# Altium schematic sheet FMC_HPC2.SchDoc: AMC FMC Carrier v4
size A2; CompanyName: WUT; Organization: WUT ISE; Address1: Warsaw Univeristy of Technology; Address2: Nowowiejska 15/19 00-665 Warsaw; Address3: t.przywozki@gmail.com; Revision: 1; SheetNumber: 8; SheetTotal: 29; Project: AMC FMC Carrier v4; ModifiedBy: -; CheckedDate: -; Title2: FPGA banks HPC2 / RTM; DivGrp: ISE; Designer: T. Przywozki; ModifiedDate: -; ProjectName: ADC/DAC MEZZANINE
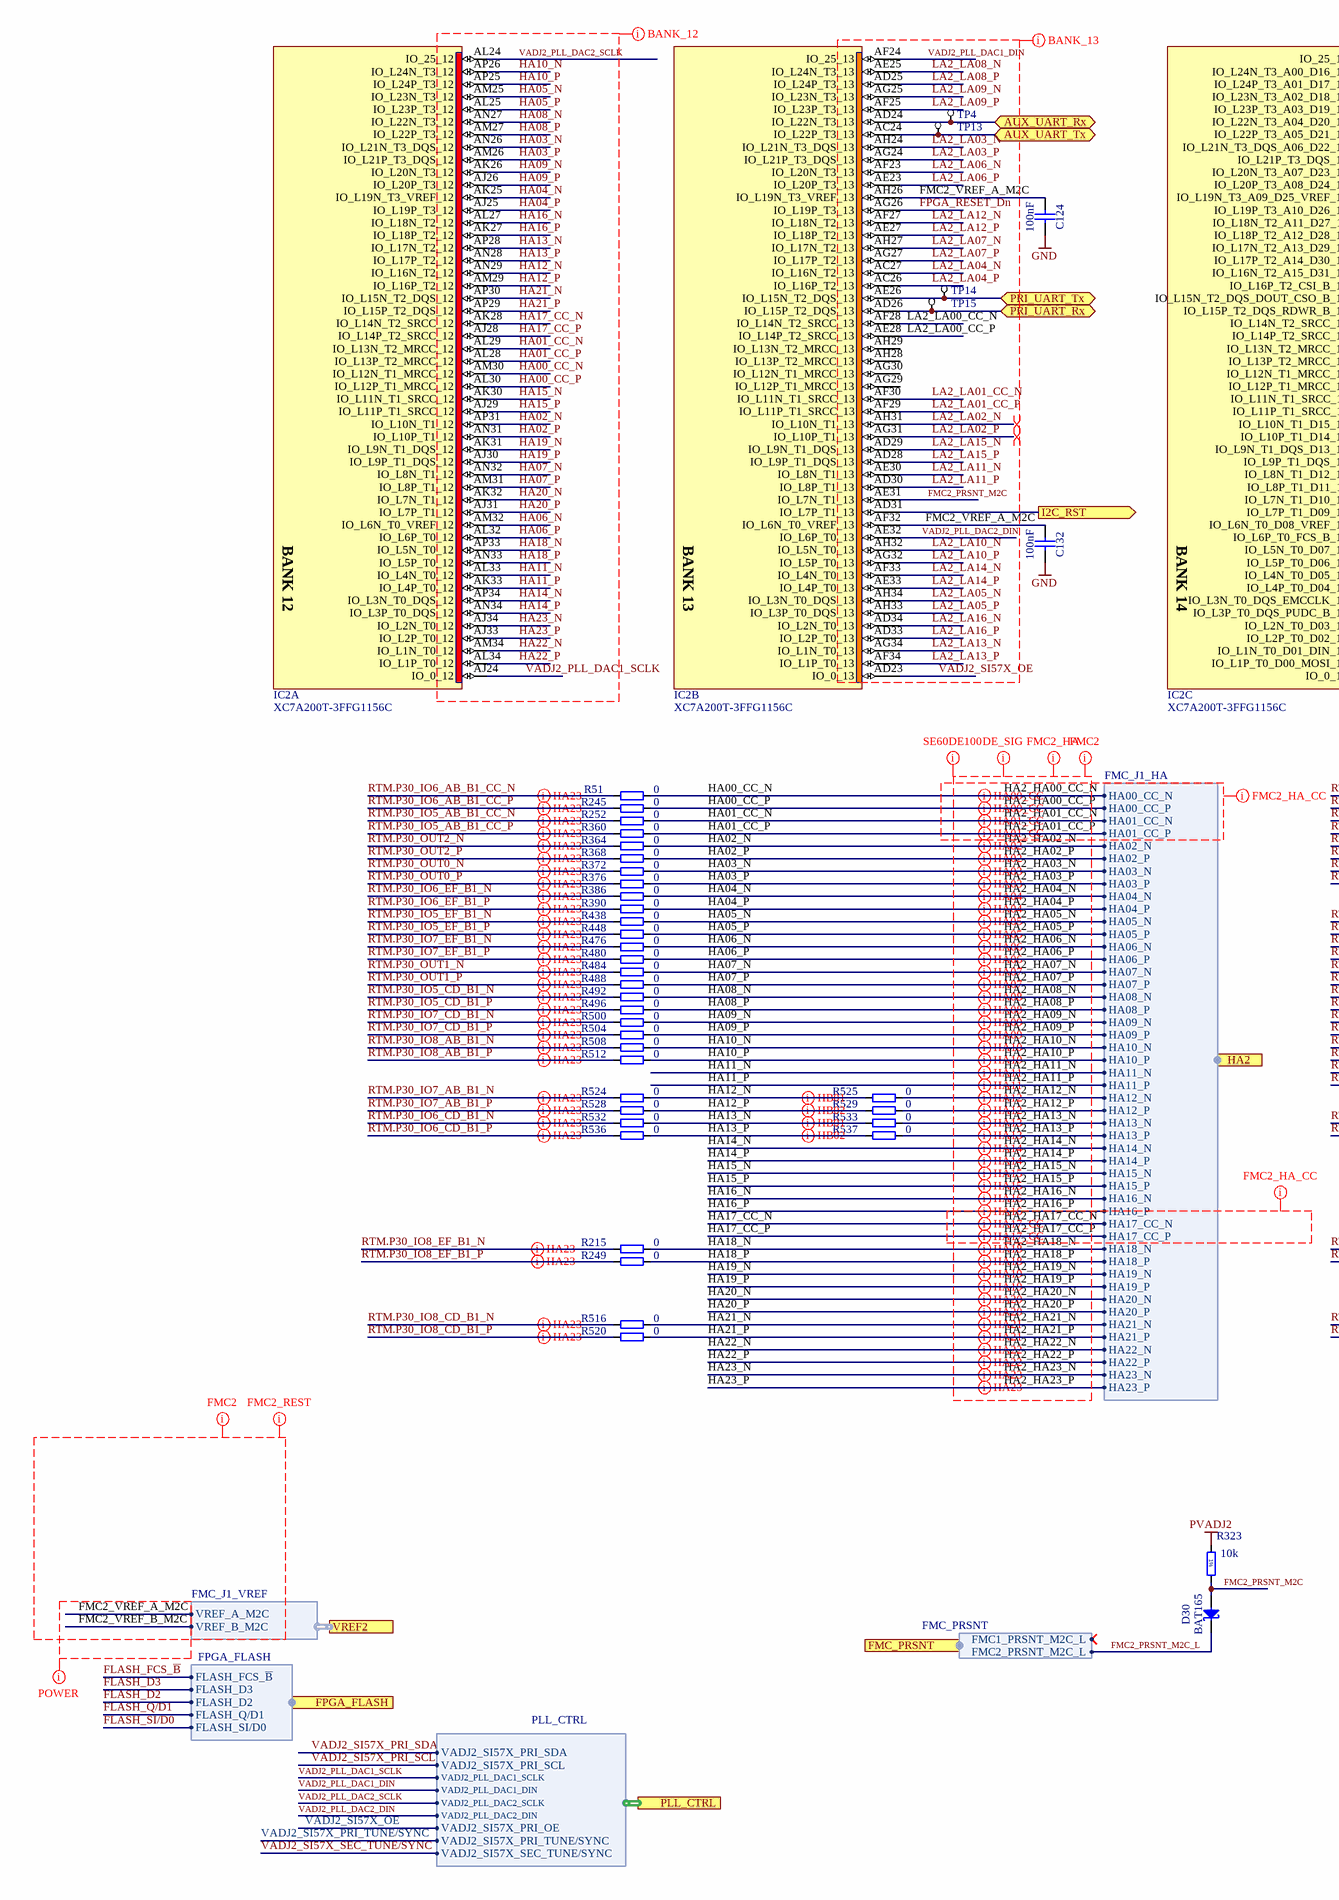
[diagram p0: FMC_HPC2.SchDoc, left]
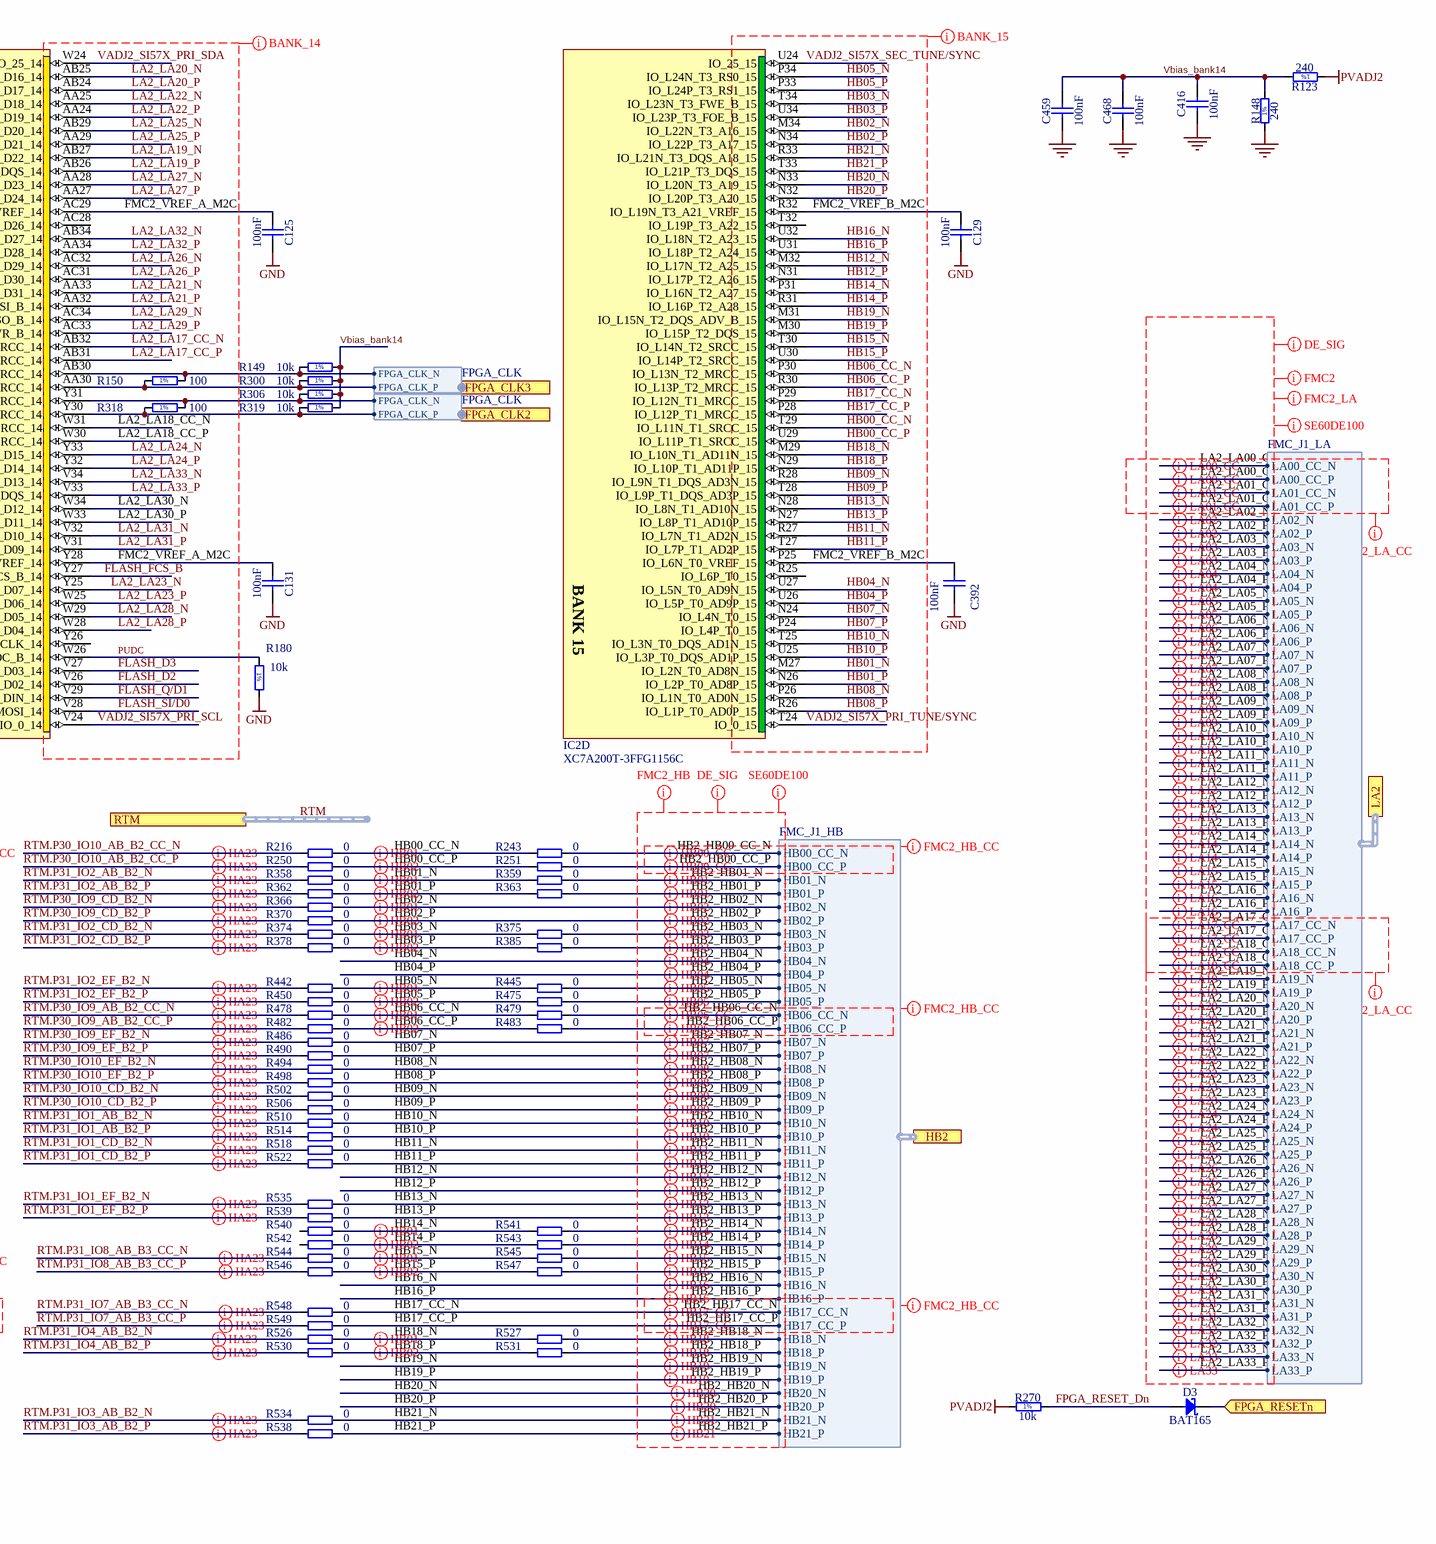
[diagram p1: FMC_HPC2.SchDoc, right]

## Parts
C124  100nF  [CAPC0603X33N]
C125  100nF  [CAPC0603X33N]
C129  100nF  [CAPC0603X33N]
C131  100nF  [CAPC0603X33N]
C132  100nF  [CAPC0603X33N]
C392  100nF  [CAPC0603X33N]
C416  100nF  [CAPC0603X33N]
C459  100nF  [CAPC0603X33N]
C468  100nF  [CAPC0603X33N]
D3  BAT165  [SOD2512X110N]
D30  BAT165  [SOD2512X110N]
IC2  XC7A200T-3FFG1156C  [BGA1156C100P34X34_3500X3500X335]  (parts A,B,C,D of 23)
R51  0  [RESC0603X28N]
R123  240  [RESC1005X40N]
R148  240  [RESC1005X40N]
R149  10k  [RESC1005X40N]
R150  100  [RESC0603X28N]
R180  10k  [RESC1005X40N]
R215  0  [RESC0603X28N]
R216  0  [RESC0603X28N]
R243  0  [RESC0603X28N]
R245  0  [RESC0603X28N]
R249  0  [RESC0603X28N]
R250  0  [RESC0603X28N]
R251  0  [RESC0603X28N]
R252  0  [RESC0603X28N]
R270  10k  [RESC1005X40N]
R300  10k  [RESC1005X40N]
R306  10k  [RESC1005X40N]
R318  100  [RESC0603X28N]
R319  10k  [RESC1005X40N]
R323  10k  [RESC1005X40N]
R358  0  [RESC0603X28N]
R359  0  [RESC0603X28N]
R360  0  [RESC0603X28N]
R362  0  [RESC0603X28N]
R363  0  [RESC0603X28N]
R364  0  [RESC0603X28N]
R366  0  [RESC0603X28N]
R368  0  [RESC0603X28N]
R370  0  [RESC0603X28N]
R372  0  [RESC0603X28N]
R374  0  [RESC0603X28N]
R375  0  [RESC0603X28N]
R376  0  [RESC0603X28N]
R378  0  [RESC0603X28N]
R385  0  [RESC0603X28N]
R386  0  [RESC0603X28N]
R390  0  [RESC0603X28N]
R438  0  [RESC0603X28N]
R442  0  [RESC0603X28N]
R445  0  [RESC0603X28N]
R448  0  [RESC0603X28N]
R450  0  [RESC0603X28N]
R475  0  [RESC0603X28N]
R476  0  [RESC0603X28N]
R478  0  [RESC0603X28N]
R479  0  [RESC0603X28N]
R480  0  [RESC0603X28N]
R482  0  [RESC0603X28N]
R483  0  [RESC0603X28N]
R484  0  [RESC0603X28N]
R486  0  [RESC0603X28N]
R488  0  [RESC0603X28N]
R490  0  [RESC0603X28N]
R492  0  [RESC0603X28N]
R494  0  [RESC0603X28N]
R496  0  [RESC0603X28N]
R498  0  [RESC0603X28N]
R500  0  [RESC0603X28N]
R502  0  [RESC0603X28N]
R504  0  [RESC0603X28N]
R506  0  [RESC0603X28N]
R508  0  [RESC0603X28N]
R510  0  [RESC0603X28N]
R512  0  [RESC0603X28N]
R514  0  [RESC0603X28N]
R516  0  [RESC0603X28N]
R518  0  [RESC0603X28N]
R520  0  [RESC0603X28N]
R522  0  [RESC0603X28N]
R524  0  [RESC0603X28N]
R525  0  [RESC0603X28N]
R526  0  [RESC0603X28N]
R527  0  [RESC0603X28N]
R528  0  [RESC0603X28N]
R529  0  [RESC0603X28N]
R530  0  [RESC0603X28N]
R531  0  [RESC0603X28N]
R532  0  [RESC0603X28N]
R533  0  [RESC0603X28N]
R534  0  [RESC0603X28N]
R535  0  [RESC0603X28N]
R536  0  [RESC0603X28N]
R537  0  [RESC0603X28N]
R538  0  [RESC0603X28N]
R539  0  [RESC0603X28N]
R540  0  [RESC0603X28N]
R541  0  [RESC0603X28N]
R542  0  [RESC0603X28N]
R543  0  [RESC0603X28N]
R544  0  [RESC0603X28N]
R545  0  [RESC0603X28N]
R546  0  [RESC0603X28N]
R547  0  [RESC0603X28N]
R548  0  [RESC0603X28N]
R549  0  [RESC0603X28N]
TP4  TP  [TP_large]  (value not drawn)
TP13  TP  [TP_large]  (value not drawn)
TP14  TP  [TP_large]  (value not drawn)
TP15  TP  [TP_large]  (value not drawn)

## Ports
AUX_UART_Rx (bidir), AUX_UART_Tx (bidir), FMC_PRSNT (harness FMC_PRSNT), FPGA_CLK2 (harness FPGA_CLK), FPGA_CLK3 (harness FPGA_CLK), FPGA_FLASH (harness FPGA_FLASH), FPGA_RESETn (in), HA2 (harness FMC_J1_HA), HB2 (harness FMC_J1_HB), I2C_RST (out), LA2 (harness FMC_J1_LA), PLL_CTRL (harness PLL_CTRL), PRI_UART_Rx (bidir), PRI_UART_Tx (bidir), RTM (harness RTM), VREF2 (harness FMC_J1_VREF)

## Harnesses
FMC_J1_LA: LA05_N, LA05_P, LA06_N, LA06_P, LA09_N, LA09_P, LA10_N, LA10_P, LA13_N, LA13_P, LA14_N, LA14_P, LA23_N, LA23_P, LA26_N, LA26_P, LA27_N, LA27_P, LA02_N, LA02_P, LA03_N, LA03_P, LA04_N, LA04_P, LA07_N, LA07_P, LA08_N, LA08_P, LA11_N, LA11_P, LA12_N, LA12_P, LA15_N, LA15_P, LA16_N, LA16_P, LA19_N, LA19_P, LA20_N, LA20_P, LA21_N, LA21_P, LA22_N, LA22_P, LA24_N, LA24_P, LA25_N, LA25_P, LA28_N, LA28_P, LA29_N, LA29_P, LA30_N, LA30_P, LA31_N, LA31_P, LA32_N, LA32_P, LA33_N, LA33_P, LA00_CC_N, LA00_CC_P, LA01_CC_N, LA01_CC_P, LA17_CC_N, LA17_CC_P, LA18_CC_N, LA18_CC_P
FMC_J1_HA: HA04_N, HA04_P, HA05_N, HA05_P, HA08_N, HA08_P, HA09_N, HA09_P, HA12_N, HA12_P, HA13_N, HA13_P, HA15_N, HA15_P, HA16_N, HA16_P, HA19_N, HA19_P, HA20_N, HA20_P, HA02_N, HA02_P, HA03_N, HA03_P, HA06_N, HA06_P, HA07_N, HA07_P, HA10_N, HA10_P, HA11_N, HA11_P, HA14_N, HA14_P, HA18_N, HA18_P, HA21_N, HA21_P, HA22_N, HA22_P, HA23_N, HA23_P, HA17_CC_N, HA17_CC_P, HA00_CC_N, HA00_CC_P, HA01_CC_N, HA01_CC_P
FMC_J1_HB: HB02_N, HB02_P, HB03_N, HB03_P, HB04_N, HB04_P, HB05_N, HB05_P, HB08_N, HB08_P, HB09_N, HB09_P, HB12_N, HB12_P, HB13_N, HB13_P, HB16_N, HB16_P, HB19_N, HB19_P, HB20_N, HB20_P, HB21_N, HB21_P, HB01_N, HB01_P, HB07_N, HB07_P, HB10_N, HB10_P, HB11_N, HB11_P, HB14_N, HB14_P, HB15_N, HB15_P, HB18_N, HB18_P, HB17_CC_N, HB17_CC_P, HB06_CC_N, HB06_CC_P, HB00_CC_N, HB00_CC_P
FPGA_FLASH: FLASH_FCS_~{B}, FLASH_D3, FLASH_D2, FLASH_Q/D1, FLASH_SI/D0
FMC_J1_VREF: VREF_A_M2C, VREF_B_M2C
FPGA_CLK: FPGA_CLK_N, FPGA_CLK_P
FMC_PRSNT: FMC1_PRSNT_M2C_L, FMC2_PRSNT_M2C_L
PLL_CTRL: VADJ2_PLL_DAC1_SCLK, VADJ2_PLL_DAC1_DIN, VADJ2_SI57X_PRI_OE, VADJ2_SI57X_PRI_TUNE/SYNC, VADJ2_SI57X_PRI_SDA, VADJ2_SI57X_PRI_SCL, VADJ2_SI57X_SEC_TUNE/SYNC, VADJ2_PLL_DAC2_SCLK, VADJ2_PLL_DAC2_DIN

## Nets
GND: C124.2 C125.2 C129.2 C131.2 C132.2 C392.2 C416.2 C459.2 C468.2 R148.1 R180.2
PVADJ2: R123.1 R270.1 R323.1
AUX_UART_Rx: IC2.AD24(IO_L22N_T3_13) TP4.1 ; port AUX_UART_Rx
AUX_UART_Tx: IC2.AC24(IO_L22P_T3_13) TP13.1 ; port AUX_UART_Tx
FLASH_D2: IC2.V26(IO_L2P_T0_D02_14) ; port FPGA_FLASH.FLASH_D2
FLASH_D3: IC2.V27(IO_L2N_T0_D03_14) ; port FPGA_FLASH.FLASH_D3
FLASH_FCS_~{B}: IC2.Y27(IO_L6P_T0_FCS_B_14) ; port FPGA_FLASH.FLASH_FCS_~{B}
FLASH_Q/D1: IC2.V29(IO_L1N_T0_D01_DIN_14) ; port FPGA_FLASH.FLASH_Q/D1
FLASH_SI/D0: IC2.V28(IO_L1P_T0_D00_MOSI_14) ; port FPGA_FLASH.FLASH_SI/D0
FMC2_PRSNT_M2C: D30.2(A) IC2.AE31(IO_L7N_T1_13) R323.2
FMC2_PRSNT_M2C_L: D30.1(C) ; port FMC_PRSNT.FMC2_PRSNT_M2C_L
FMC2_VREF_A_M2C: C124.1 C125.1 C131.1 C132.1 IC2.AC29(IO_L19N_T3_A09_D25_VREF_14) IC2.AF32(IO_L6N_T0_VREF_13) IC2.AH26(IO_L19N_T3_VREF_13) IC2.Y28(IO_L6N_T0_D08_VREF_14) ; port VREF2.VREF_A_M2C
FMC2_VREF_B_M2C: C129.1 C392.1 IC2.P25(IO_L6N_T0_VREF_15) IC2.R32(IO_L19N_T3_A21_VREF_15) ; port VREF2.VREF_B_M2C
FPGA_RESET_Dn: D3.2(A) IC2.AG26(IO_L19P_T3_13) R270.2
FPGA_RESETn: D3.1(C) ; port FPGA_RESETn
HA00_CC_N: IC2.AM30(IO_L12N_T1_MRCC_12) R51.2 ; port HA2.HA00_CC_N  [also labelled HA2_HA00_CC_N]
HA00_CC_P: IC2.AL30(IO_L12P_T1_MRCC_12) R245.2 ; port HA2.HA00_CC_P  [also labelled HA2_HA00_CC_P]
HA01_CC_N: IC2.AL29(IO_L13N_T2_MRCC_12) R252.2 ; port HA2.HA01_CC_N  [also labelled HA2_HA01_CC_N]
HA01_CC_P: IC2.AL28(IO_L13P_T2_MRCC_12) R360.2 ; port HA2.HA01_CC_P  [also labelled HA2_HA01_CC_P]
HA2_HA12_N: R525.2 ; port HA2.HA12_N
HA2_HA12_P: R529.2 ; port HA2.HA12_P
HA2_HA13_N: R533.2 ; port HA2.HA13_N
HA2_HA13_P: R537.2 ; port HA2.HA13_P
HA02_N: IC2.AP31(IO_L10N_T1_12) R364.2 ; port HA2.HA02_N  [also labelled HA2_HA02_N]
HA02_P: IC2.AN31(IO_L10P_T1_12) R368.2 ; port HA2.HA02_P  [also labelled HA2_HA02_P]
HA03_N: IC2.AN26(IO_L21N_T3_DQS_12) R372.2 ; port HA2.HA03_N  [also labelled HA2_HA03_N]
HA03_P: IC2.AM26(IO_L21P_T3_DQS_12) R376.2 ; port HA2.HA03_P  [also labelled HA2_HA03_P]
HA04_N: IC2.AK25(IO_L19N_T3_VREF_12) R386.2 ; port HA2.HA04_N  [also labelled HA2_HA04_N]
HA04_P: IC2.AJ25(IO_L19P_T3_12) R390.2 ; port HA2.HA04_P  [also labelled HA2_HA04_P]
HA05_N: IC2.AM25(IO_L23N_T3_12) R438.2 ; port HA2.HA05_N  [also labelled HA2_HA05_N]
HA05_P: IC2.AL25(IO_L23P_T3_12) R448.2 ; port HA2.HA05_P  [also labelled HA2_HA05_P]
HA06_N: IC2.AM32(IO_L6N_T0_VREF_12) R476.2 ; port HA2.HA06_N  [also labelled HA2_HA06_N]
HA06_P: IC2.AL32(IO_L6P_T0_12) R480.2 ; port HA2.HA06_P  [also labelled HA2_HA06_P]
HA07_N: IC2.AN32(IO_L8N_T1_12) R484.2 ; port HA2.HA07_N  [also labelled HA2_HA07_N]
HA07_P: IC2.AM31(IO_L8P_T1_12) R488.2 ; port HA2.HA07_P  [also labelled HA2_HA07_P]
HA08_N: IC2.AN27(IO_L22N_T3_12) R492.2 ; port HA2.HA08_N  [also labelled HA2_HA08_N]
HA08_P: IC2.AM27(IO_L22P_T3_12) R496.2 ; port HA2.HA08_P  [also labelled HA2_HA08_P]
HA09_N: IC2.AK26(IO_L20N_T3_12) R500.2 ; port HA2.HA09_N  [also labelled HA2_HA09_N]
HA09_P: IC2.AJ26(IO_L20P_T3_12) R504.2 ; port HA2.HA09_P  [also labelled HA2_HA09_P]
HA10_N: IC2.AP26(IO_L24N_T3_12) R508.2 ; port HA2.HA10_N  [also labelled HA2_HA10_N]
HA10_P: IC2.AP25(IO_L24P_T3_12) R512.2 ; port HA2.HA10_P  [also labelled HA2_HA10_P]
HA11_N: IC2.AL33(IO_L4N_T0_12) ; port HA2.HA11_N  [also labelled HA2_HA11_N]
HA11_P: IC2.AK33(IO_L4P_T0_12) ; port HA2.HA11_P  [also labelled HA2_HA11_P]
HA12_N: IC2.AN29(IO_L16N_T2_12) R524.2 R525.1
HA12_P: IC2.AM29(IO_L16P_T2_12) R528.2 R529.1
HA13_N: IC2.AP28(IO_L17N_T2_12) R532.2 R533.1
HA13_P: IC2.AN28(IO_L17P_T2_12) R536.2 R537.1
HA14_N: IC2.AP34(IO_L3N_T0_DQS_12) ; port HA2.HA14_N  [also labelled HA2_HA14_N]
HA14_P: IC2.AN34(IO_L3P_T0_DQS_12) ; port HA2.HA14_P  [also labelled HA2_HA14_P]
HA15_N: IC2.AK30(IO_L11N_T1_SRCC_12) ; port HA2.HA15_N  [also labelled HA2_HA15_N]
HA15_P: IC2.AJ29(IO_L11P_T1_SRCC_12) ; port HA2.HA15_P  [also labelled HA2_HA15_P]
HA16_N: IC2.AL27(IO_L18N_T2_12) ; port HA2.HA16_N  [also labelled HA2_HA16_N]
HA16_P: IC2.AK27(IO_L18P_T2_12) ; port HA2.HA16_P  [also labelled HA2_HA16_P]
HA17_CC_N: IC2.AK28(IO_L14N_T2_SRCC_12) ; port HA2.HA17_CC_N  [also labelled HA2_HA17_CC_N]
HA17_CC_P: IC2.AJ28(IO_L14P_T2_SRCC_12) ; port HA2.HA17_CC_P  [also labelled HA2_HA17_CC_P]
HA18_N: IC2.AP33(IO_L5N_T0_12) R215.2 ; port HA2.HA18_N  [also labelled HA2_HA18_N]
HA18_P: IC2.AN33(IO_L5P_T0_12) R249.2 ; port HA2.HA18_P  [also labelled HA2_HA18_P]
HA19_N: IC2.AK31(IO_L9N_T1_DQS_12) ; port HA2.HA19_N  [also labelled HA2_HA19_N]
HA19_P: IC2.AJ30(IO_L9P_T1_DQS_12) ; port HA2.HA19_P  [also labelled HA2_HA19_P]
HA20_N: IC2.AK32(IO_L7N_T1_12) ; port HA2.HA20_N  [also labelled HA2_HA20_N]
HA20_P: IC2.AJ31(IO_L7P_T1_12) ; port HA2.HA20_P  [also labelled HA2_HA20_P]
HA21_N: IC2.AP30(IO_L15N_T2_DQS_12) R516.2 ; port HA2.HA21_N  [also labelled HA2_HA21_N]
HA21_P: IC2.AP29(IO_L15P_T2_DQS_12) R520.2 ; port HA2.HA21_P  [also labelled HA2_HA21_P]
HA22_N: IC2.AM34(IO_L1N_T0_12) ; port HA2.HA22_N  [also labelled HA2_HA22_N]
HA22_P: IC2.AL34(IO_L1P_T0_12) ; port HA2.HA22_P  [also labelled HA2_HA22_P]
HA23_N: IC2.AJ34(IO_L2N_T0_12) ; port HA2.HA23_N  [also labelled HA2_HA23_N]
HA23_P: IC2.AJ33(IO_L2P_T0_12) ; port HA2.HA23_P  [also labelled HA2_HA23_P]
HB00_CC_N: IC2.T29(IO_L11N_T1_SRCC_15) R216.2 R243.1
HB00_CC_P: IC2.U29(IO_L11P_T1_SRCC_15) R250.2 R251.1
HB01_N: IC2.M27(IO_L2N_T0_AD8N_15) R358.2 R359.1
HB01_P: IC2.N26(IO_L2P_T0_AD8P_15) R362.2 R363.1
HB2_HB00_CC_N: R243.2 ; port HB2.HB00_CC_N
HB2_HB00_CC_P: R251.2 ; port HB2.HB00_CC_P
HB2_HB01_N: R359.2 ; port HB2.HB01_N
HB2_HB01_P: R363.2 ; port HB2.HB01_P
HB2_HB03_N: R375.2 ; port HB2.HB03_N
HB2_HB03_P: R385.2 ; port HB2.HB03_P
HB2_HB05_N: R445.2 ; port HB2.HB05_N
HB2_HB05_P: R475.2 ; port HB2.HB05_P
HB2_HB06_CC_N: R479.2 ; port HB2.HB06_CC_N
HB2_HB06_CC_P: R483.2 ; port HB2.HB06_CC_P
HB2_HB14_N: R541.2 ; port HB2.HB14_N
HB2_HB14_P: R543.2 ; port HB2.HB14_P
HB2_HB15_N: R545.2 ; port HB2.HB15_N
HB2_HB15_P: R547.2 ; port HB2.HB15_P
HB2_HB18_N: R527.2 ; port HB2.HB18_N
HB2_HB18_P: R531.2 ; port HB2.HB18_P
HB02_N: IC2.M34(IO_L22N_T3_A16_15) R366.2 ; port HB2.HB02_N  [also labelled HB2_HB02_N]
HB02_P: IC2.N34(IO_L22P_T3_A17_15) R370.2 ; port HB2.HB02_P  [also labelled HB2_HB02_P]
HB03_N: IC2.T34(IO_L23N_T3_FWE_B_15) R374.2 R375.1
HB03_P: IC2.U34(IO_L23P_T3_FOE_B_15) R378.2 R385.1
HB04_N: IC2.U27(IO_L5N_T0_AD9N_15) ; port HB2.HB04_N  [also labelled HB2_HB04_N]
HB04_P: IC2.U26(IO_L5P_T0_AD9P_15) ; port HB2.HB04_P  [also labelled HB2_HB04_P]
HB05_N: IC2.P34(IO_L24N_T3_RS0_15) R442.2 R445.1
HB05_P: IC2.P33(IO_L24P_T3_RS1_15) R450.2 R475.1
HB06_CC_N: IC2.P30(IO_L13N_T2_MRCC_15) R478.2 R479.1
HB06_CC_P: IC2.R30(IO_L13P_T2_MRCC_15) R482.2 R483.1
HB07_N: IC2.N24(IO_L4N_T0_15) R486.2 ; port HB2.HB07_N  [also labelled HB2_HB07_N]
HB07_P: IC2.P24(IO_L4P_T0_15) R490.2 ; port HB2.HB07_P  [also labelled HB2_HB07_P]
HB08_N: IC2.P26(IO_L1N_T0_AD0N_15) R494.2 ; port HB2.HB08_N  [also labelled HB2_HB08_N]
HB08_P: IC2.R26(IO_L1P_T0_AD0P_15) R498.2 ; port HB2.HB08_P  [also labelled HB2_HB08_P]
HB09_N: IC2.R28(IO_L9N_T1_DQS_AD3N_15) R502.2 ; port HB2.HB09_N  [also labelled HB2_HB09_N]
HB09_P: IC2.T28(IO_L9P_T1_DQS_AD3P_15) R506.2 ; port HB2.HB09_P  [also labelled HB2_HB09_P]
HB10_N: IC2.T25(IO_L3N_T0_DQS_AD1N_15) R510.2 ; port HB2.HB10_N  [also labelled HB2_HB10_N]
HB10_P: IC2.U25(IO_L3P_T0_DQS_AD1P_15) R514.2 ; port HB2.HB10_P  [also labelled HB2_HB10_P]
HB11_N: IC2.R27(IO_L7N_T1_AD2N_15) R518.2 ; port HB2.HB11_N  [also labelled HB2_HB11_N]
HB11_P: IC2.T27(IO_L7P_T1_AD2P_15) R522.2 ; port HB2.HB11_P  [also labelled HB2_HB11_P]
HB12_N: IC2.M32(IO_L17N_T2_A25_15) ; port HB2.HB12_N  [also labelled HB2_HB12_N]
HB12_P: IC2.N31(IO_L17P_T2_A26_15) ; port HB2.HB12_P  [also labelled HB2_HB12_P]
HB13_N: IC2.N28(IO_L8N_T1_AD10N_15) R535.2 ; port HB2.HB13_N  [also labelled HB2_HB13_N]
HB13_P: IC2.N27(IO_L8P_T1_AD10P_15) R539.2 ; port HB2.HB13_P  [also labelled HB2_HB13_P]
HB14_N: IC2.P31(IO_L16N_T2_A27_15) R540.2 R541.1
HB14_P: IC2.R31(IO_L16P_T2_A28_15) R542.2 R543.1
HB15_N: IC2.T30(IO_L14N_T2_SRCC_15) R544.2 R545.1
HB15_P: IC2.U30(IO_L14P_T2_SRCC_15) R546.2 R547.1
HB16_N: IC2.U32(IO_L18N_T2_A23_15) ; port HB2.HB16_N  [also labelled HB2_HB16_N]
HB16_P: IC2.U31(IO_L18P_T2_A24_15) ; port HB2.HB16_P  [also labelled HB2_HB16_P]
HB17_CC_N: IC2.P29(IO_L12N_T1_MRCC_15) R548.2 ; port HB2.HB17_CC_N  [also labelled HB2_HB17_CC_N]
HB17_CC_P: IC2.P28(IO_L12P_T1_MRCC_15) R549.2 ; port HB2.HB17_CC_P  [also labelled HB2_HB17_CC_P]
HB18_N: IC2.M29(IO_L10N_T1_AD11N_15) R526.2 R527.1
HB18_P: IC2.N29(IO_L10P_T1_AD11P_15) R530.2 R531.1
HB19_N: IC2.M31(IO_L15N_T2_DQS_ADV_B_15) ; port HB2.HB19_N  [also labelled HB2_HB19_N]
HB19_P: IC2.M30(IO_L15P_T2_DQS_15) ; port HB2.HB19_P  [also labelled HB2_HB19_P]
HB20_N: IC2.N33(IO_L20N_T3_A19_15) ; port HB2.HB20_N  [also labelled HB2_HB20_N]
HB20_P: IC2.N32(IO_L20P_T3_A20_15) ; port HB2.HB20_P  [also labelled HB2_HB20_P]
HB21_N: IC2.R33(IO_L21N_T3_DQS_A18_15) R534.2 ; port HB2.HB21_N  [also labelled HB2_HB21_N]
HB21_P: IC2.T33(IO_L21P_T3_DQS_15) R538.2 ; port HB2.HB21_P  [also labelled HB2_HB21_P]
I2C_RST: IC2.AD31(IO_L7P_T1_13) ; port I2C_RST
LA2_LA00_CC_N: IC2.AF28(IO_L14N_T2_SRCC_13) ; port LA2.LA00_CC_N
LA2_LA00_CC_P: IC2.AE28(IO_L14P_T2_SRCC_13) ; port LA2.LA00_CC_P
LA2_LA01_CC_N: IC2.AF30(IO_L11N_T1_SRCC_13) ; port LA2.LA01_CC_N
LA2_LA01_CC_P: IC2.AF29(IO_L11P_T1_SRCC_13) ; port LA2.LA01_CC_P
LA2_LA02_N: IC2.AH31(IO_L10N_T1_13) ; port LA2.LA02_N
LA2_LA02_P: IC2.AG31(IO_L10P_T1_13) ; port LA2.LA02_P
LA2_LA03_N: IC2.AH24(IO_L21N_T3_DQS_13) ; port LA2.LA03_N
LA2_LA03_P: IC2.AG24(IO_L21P_T3_DQS_13) ; port LA2.LA03_P
LA2_LA04_N: IC2.AC27(IO_L16N_T2_13) ; port LA2.LA04_N
LA2_LA04_P: IC2.AC26(IO_L16P_T2_13) ; port LA2.LA04_P
LA2_LA05_N: IC2.AH34(IO_L3N_T0_DQS_13) ; port LA2.LA05_N
LA2_LA05_P: IC2.AH33(IO_L3P_T0_DQS_13) ; port LA2.LA05_P
LA2_LA06_N: IC2.AF23(IO_L20N_T3_13) ; port LA2.LA06_N
LA2_LA06_P: IC2.AE23(IO_L20P_T3_13) ; port LA2.LA06_P
LA2_LA07_N: IC2.AH27(IO_L17N_T2_13) ; port LA2.LA07_N
LA2_LA07_P: IC2.AG27(IO_L17P_T2_13) ; port LA2.LA07_P
LA2_LA08_N: IC2.AE25(IO_L24N_T3_13) ; port LA2.LA08_N
LA2_LA08_P: IC2.AD25(IO_L24P_T3_13) ; port LA2.LA08_P
LA2_LA09_N: IC2.AG25(IO_L23N_T3_13) ; port LA2.LA09_N
LA2_LA09_P: IC2.AF25(IO_L23P_T3_13) ; port LA2.LA09_P
LA2_LA10_N: IC2.AH32(IO_L5N_T0_13) ; port LA2.LA10_N
LA2_LA10_P: IC2.AG32(IO_L5P_T0_13) ; port LA2.LA10_P
LA2_LA11_N: IC2.AE30(IO_L8N_T1_13) ; port LA2.LA11_N
LA2_LA11_P: IC2.AD30(IO_L8P_T1_13) ; port LA2.LA11_P
LA2_LA12_N: IC2.AF27(IO_L18N_T2_13) ; port LA2.LA12_N
LA2_LA12_P: IC2.AE27(IO_L18P_T2_13) ; port LA2.LA12_P
LA2_LA13_N: IC2.AG34(IO_L1N_T0_13) ; port LA2.LA13_N
LA2_LA13_P: IC2.AF34(IO_L1P_T0_13) ; port LA2.LA13_P
LA2_LA14_N: IC2.AF33(IO_L4N_T0_13) ; port LA2.LA14_N
LA2_LA14_P: IC2.AE33(IO_L4P_T0_13) ; port LA2.LA14_P
LA2_LA15_N: IC2.AD29(IO_L9N_T1_DQS_13) ; port LA2.LA15_N
LA2_LA15_P: IC2.AD28(IO_L9P_T1_DQS_13) ; port LA2.LA15_P
LA2_LA16_N: IC2.AD34(IO_L2N_T0_13) ; port LA2.LA16_N
LA2_LA16_P: IC2.AD33(IO_L2P_T0_13) ; port LA2.LA16_P
LA2_LA17_CC_N: IC2.AB32(IO_L14N_T2_SRCC_14) ; port LA2.LA17_CC_N
LA2_LA17_CC_P: IC2.AB31(IO_L14P_T2_SRCC_14) ; port LA2.LA17_CC_P
LA2_LA18_CC_N: IC2.W31(IO_L11N_T1_SRCC_14) ; port LA2.LA18_CC_N
LA2_LA18_CC_P: IC2.W30(IO_L11P_T1_SRCC_14) ; port LA2.LA18_CC_P
LA2_LA19_N: IC2.AB27(IO_L21N_T3_DQS_A06_D22_14) ; port LA2.LA19_N
LA2_LA19_P: IC2.AB26(IO_L21P_T3_DQS_14) ; port LA2.LA19_P
LA2_LA20_N: IC2.AB25(IO_L24N_T3_A00_D16_14) ; port LA2.LA20_N
LA2_LA20_P: IC2.AB24(IO_L24P_T3_A01_D17_14) ; port LA2.LA20_P
LA2_LA21_N: IC2.AA33(IO_L16N_T2_A15_D31_14) ; port LA2.LA21_N
LA2_LA21_P: IC2.AA32(IO_L16P_T2_CSI_B_14) ; port LA2.LA21_P
LA2_LA22_N: IC2.AA25(IO_L23N_T3_A02_D18_14) ; port LA2.LA22_N
LA2_LA22_P: IC2.AA24(IO_L23P_T3_A03_D19_14) ; port LA2.LA22_P
LA2_LA23_N: IC2.Y25(IO_L5N_T0_D07_14) ; port LA2.LA23_N
LA2_LA23_P: IC2.W25(IO_L5P_T0_D06_14) ; port LA2.LA23_P
LA2_LA24_N: IC2.Y33(IO_L10N_T1_D15_14) ; port LA2.LA24_N
LA2_LA24_P: IC2.Y32(IO_L10P_T1_D14_14) ; port LA2.LA24_P
LA2_LA25_N: IC2.AB29(IO_L22N_T3_A04_D20_14) ; port LA2.LA25_N
LA2_LA25_P: IC2.AA29(IO_L22P_T3_A05_D21_14) ; port LA2.LA25_P
LA2_LA26_N: IC2.AC32(IO_L17N_T2_A13_D29_14) ; port LA2.LA26_N
LA2_LA26_P: IC2.AC31(IO_L17P_T2_A14_D30_14) ; port LA2.LA26_P
LA2_LA27_N: IC2.AA28(IO_L20N_T3_A07_D23_14) ; port LA2.LA27_N
LA2_LA27_P: IC2.AA27(IO_L20P_T3_A08_D24_14) ; port LA2.LA27_P
LA2_LA28_N: IC2.W29(IO_L4N_T0_D05_14) ; port LA2.LA28_N
LA2_LA28_P: IC2.W28(IO_L4P_T0_D04_14) ; port LA2.LA28_P
LA2_LA29_N: IC2.AC34(IO_L15N_T2_DQS_DOUT_CSO_B_14) ; port LA2.LA29_N
LA2_LA29_P: IC2.AC33(IO_L15P_T2_DQS_RDWR_B_14) ; port LA2.LA29_P
LA2_LA30_N: IC2.W34(IO_L8N_T1_D12_14) ; port LA2.LA30_N
LA2_LA30_P: IC2.W33(IO_L8P_T1_D11_14) ; port LA2.LA30_P
LA2_LA31_N: IC2.V32(IO_L7N_T1_D10_14) ; port LA2.LA31_N
LA2_LA31_P: IC2.V31(IO_L7P_T1_D09_14) ; port LA2.LA31_P
LA2_LA32_N: IC2.AB34(IO_L18N_T2_A11_D27_14) ; port LA2.LA32_N
LA2_LA32_P: IC2.AA34(IO_L18P_T2_A12_D28_14) ; port LA2.LA32_P
LA2_LA33_N: IC2.V34(IO_L9N_T1_DQS_D13_14) ; port LA2.LA33_N
LA2_LA33_P: IC2.V33(IO_L9P_T1_DQS_14) ; port LA2.LA33_P
PRI_UART_Rx: IC2.AD26(IO_L15P_T2_DQS_13) TP15.1 ; port PRI_UART_Rx
PRI_UART_Tx: IC2.AE26(IO_L15N_T2_DQS_13) TP14.1 ; port PRI_UART_Tx
PUDC: IC2.W26(IO_L3P_T0_DQS_PUDC_B_14) R180.1
RTM.P30_IO5_AB_B1_CC_N: R252.1
RTM.P30_IO5_AB_B1_CC_P: R360.1
RTM.P30_IO5_CD_B1_N: R492.1
RTM.P30_IO5_CD_B1_P: R496.1
RTM.P30_IO5_EF_B1_N: R438.1
RTM.P30_IO5_EF_B1_P: R448.1
RTM.P30_IO6_AB_B1_CC_N: R51.1
RTM.P30_IO6_AB_B1_CC_P: R245.1
RTM.P30_IO6_CD_B1_N: R532.1
RTM.P30_IO6_CD_B1_P: R536.1
RTM.P30_IO6_EF_B1_N: R386.1
RTM.P30_IO6_EF_B1_P: R390.1
RTM.P30_IO7_AB_B1_N: R524.1
RTM.P30_IO7_AB_B1_P: R528.1
RTM.P30_IO7_CD_B1_N: R500.1
RTM.P30_IO7_CD_B1_P: R504.1
RTM.P30_IO7_EF_B1_N: R476.1
RTM.P30_IO7_EF_B1_P: R480.1
RTM.P30_IO8_AB_B1_N: R508.1
RTM.P30_IO8_AB_B1_P: R512.1
RTM.P30_IO8_CD_B1_N: R516.1
RTM.P30_IO8_CD_B1_P: R520.1
RTM.P30_IO8_EF_B1_N: R215.1
RTM.P30_IO8_EF_B1_P: R249.1
RTM.P30_IO9_AB_B2_CC_N: R478.1
RTM.P30_IO9_AB_B2_CC_P: R482.1
RTM.P30_IO9_CD_B2_N: R366.1
RTM.P30_IO9_CD_B2_P: R370.1
RTM.P30_IO9_EF_B2_N: R486.1
RTM.P30_IO9_EF_B2_P: R490.1
RTM.P30_IO10_AB_B2_CC_N: R216.1
RTM.P30_IO10_AB_B2_CC_P: R250.1
RTM.P30_IO10_CD_B2_N: R502.1
RTM.P30_IO10_CD_B2_P: R506.1
RTM.P30_IO10_EF_B2_N: R494.1
RTM.P30_IO10_EF_B2_P: R498.1
RTM.P30_OUT0_N: R372.1
RTM.P30_OUT0_P: R376.1
RTM.P30_OUT1_N: R484.1
RTM.P30_OUT1_P: R488.1
RTM.P30_OUT2_N: R364.1
RTM.P30_OUT2_P: R368.1
RTM.P31_IO1_AB_B2_N: R510.1
RTM.P31_IO1_AB_B2_P: R514.1
RTM.P31_IO1_CD_B2_N: R518.1
RTM.P31_IO1_CD_B2_P: R522.1
RTM.P31_IO1_EF_B2_N: R535.1
RTM.P31_IO1_EF_B2_P: R539.1
RTM.P31_IO2_AB_B2_N: R358.1
RTM.P31_IO2_AB_B2_P: R362.1
RTM.P31_IO2_CD_B2_N: R374.1
RTM.P31_IO2_CD_B2_P: R378.1
RTM.P31_IO2_EF_B2_N: R442.1
RTM.P31_IO2_EF_B2_P: R450.1
RTM.P31_IO3_AB_B2_N: R534.1
RTM.P31_IO3_AB_B2_P: R538.1
RTM.P31_IO4_AB_B2_N: R526.1
RTM.P31_IO4_AB_B2_P: R530.1
RTM.P31_IO7_AB_B3_CC_N: R548.1
RTM.P31_IO7_AB_B3_CC_P: R549.1
RTM.P31_IO8_AB_B3_CC_N: R544.1
RTM.P31_IO8_AB_B3_CC_P: R546.1
VADJ2_PLL_DAC1_DIN: IC2.AF24(IO_25_13) ; port PLL_CTRL.VADJ2_PLL_DAC1_DIN
VADJ2_PLL_DAC1_SCLK: IC2.AJ24(IO_0_12) ; port PLL_CTRL.VADJ2_PLL_DAC1_SCLK
VADJ2_PLL_DAC2_DIN: IC2.AE32(IO_L6P_T0_13) ; port PLL_CTRL.VADJ2_PLL_DAC2_DIN
VADJ2_PLL_DAC2_SCLK: IC2.AL24(IO_25_12) ; port PLL_CTRL.VADJ2_PLL_DAC2_SCLK
VADJ2_SI57X_OE: IC2.AD23(IO_0_13) ; port PLL_CTRL.VADJ2_SI57X_PRI_OE
VADJ2_SI57X_PRI_SCL: IC2.V24(IO_0_14) ; port PLL_CTRL.VADJ2_SI57X_PRI_SCL
VADJ2_SI57X_PRI_SDA: IC2.W24(IO_25_14) ; port PLL_CTRL.VADJ2_SI57X_PRI_SDA
VADJ2_SI57X_PRI_TUNE/SYNC: IC2.T24(IO_0_15) ; port PLL_CTRL.VADJ2_SI57X_PRI_TUNE/SYNC
VADJ2_SI57X_SEC_TUNE/SYNC: IC2.U24(IO_25_15) ; port PLL_CTRL.VADJ2_SI57X_SEC_TUNE/SYNC
Vbias_bank14: C416.1 C459.1 C468.1 R123.2 R148.2 R149.2 R300.2 R306.2 R319.2
NetIC2_AA30: IC2.AA30(IO_L13P_T2_MRCC_14) R150.1 R300.1 ; port FPGA_CLK3.FPGA_CLK_P
NetIC2_AB30: IC2.AB30(IO_L13N_T2_MRCC_14) R149.1 R150.2 ; port FPGA_CLK3.FPGA_CLK_N
NetIC2_Y30: IC2.Y30(IO_L12P_T1_MRCC_14) R318.1 R319.1 ; port FPGA_CLK2.FPGA_CLK_P
NetIC2_Y31: IC2.Y31(IO_L12N_T1_MRCC_14) R306.1 R318.2 ; port FPGA_CLK2.FPGA_CLK_N

Not connected (* = marked no-connect by the designer): IC2 AC28(IO_L19P_T3_A10_D26_14) AG29(IO_L12P_T1_MRCC_13) AG30(IO_L12N_T1_MRCC_13) AH28(IO_L13P_T2_MRCC_13) AH29(IO_L13N_T2_MRCC_13) R25(IO_L6P_T0_15) T32(IO_L19P_T3_A22_15) Y26(IO_L3N_T0_DQS_EMCCLK_14); R540 1; R542 1

## Buses and harness runs
harness RTM = port RTM

## Layout directives
differential pair: HA00_CC_N, HA00_CC_P, HA01_CC_N, HA01_CC_P, HA2_HA12_N, HA2_HA12_P, HA2_HA13_N, HA2_HA13_P, HA02_N, HA02_P, HA03_N, HA03_P, HA04_N, HA04_P, HA05_N, HA05_P, HA06_N, HA06_P, HA07_N, HA07_P, HA08_N, HA08_P, HA09_N, HA09_P, HA10_N, HA10_P, HA11_N, HA11_P, HA12_N, HA12_P, HA13_N, HA13_P, HA14_N, HA14_P, HA15_N, HA15_P, HA16_N, HA16_P, HA17_CC_N, HA17_CC_P, HA18_N, HA18_P, HA19_N, HA19_P, HA20_N, HA20_P, HA21_N, HA21_P, HA22_N, HA22_P, HA23_N, HA23_P, HB00_CC_N, HB00_CC_P, HB01_N, HB01_P, HB2_HB00_CC_N, HB2_HB00_CC_P, HB2_HB01_N, HB2_HB01_P, HB2_HB03_N, HB2_HB03_P, HB2_HB05_N, HB2_HB05_P, HB2_HB06_CC_N, HB2_HB06_CC_P, HB2_HB14_N, HB2_HB14_P, HB2_HB15_N, HB2_HB15_P, HB2_HB18_N, HB2_HB18_P, HB02_N, HB02_P, HB03_N, HB03_P, HB04_N, HB04_P, HB05_N, HB05_P, HB06_CC_N, HB06_CC_P, HB07_N, HB07_P, HB08_N, HB08_P, HB09_N, HB09_P, HB10_N, HB10_P, HB11_N, HB11_P, HB12_N, HB12_P, HB13_N, HB13_P, HB14_N, HB14_P, HB15_N, HB15_P, HB16_N, HB16_P, HB17_CC_N, HB17_CC_P, HB18_N, HB18_P, HB19_N, HB19_P, HB20_N, HB20_P, HB21_N, HB21_P, LA2_LA00_CC_N, LA2_LA00_CC_P, LA2_LA01_CC_N, LA2_LA01_CC_P, LA2_LA02_N, LA2_LA02_P, LA2_LA03_N, LA2_LA03_P, LA2_LA04_N, LA2_LA04_P, LA2_LA05_N, LA2_LA05_P, LA2_LA06_N, LA2_LA06_P, LA2_LA07_N, LA2_LA07_P, LA2_LA08_N, LA2_LA08_P, LA2_LA09_N, LA2_LA09_P, LA2_LA10_N, LA2_LA10_P, LA2_LA11_N, LA2_LA11_P, LA2_LA12_N, LA2_LA12_P, LA2_LA13_N, LA2_LA13_P, LA2_LA14_N, LA2_LA14_P, LA2_LA15_N, LA2_LA15_P, LA2_LA16_N, LA2_LA16_P, LA2_LA17_CC_N, LA2_LA17_CC_P, LA2_LA18_CC_N, LA2_LA18_CC_P, LA2_LA19_N, LA2_LA19_P, LA2_LA20_N, LA2_LA20_P, LA2_LA21_N, LA2_LA21_P, LA2_LA22_N, LA2_LA22_P, LA2_LA23_N, LA2_LA23_P, LA2_LA24_N, LA2_LA24_P, LA2_LA25_N, LA2_LA25_P, LA2_LA26_N, LA2_LA26_P, LA2_LA27_N, LA2_LA27_P, LA2_LA28_N, LA2_LA28_P, LA2_LA29_N, LA2_LA29_P, LA2_LA30_N, LA2_LA30_P, LA2_LA31_N, LA2_LA31_P, LA2_LA32_N, LA2_LA32_P, LA2_LA33_N, LA2_LA33_P, RTM.P30_IO5_AB_B1_CC_N, RTM.P30_IO5_AB_B1_CC_P, RTM.P30_IO5_CD_B1_N, RTM.P30_IO5_CD_B1_P, RTM.P30_IO5_EF_B1_N, RTM.P30_IO5_EF_B1_P, RTM.P30_IO6_AB_B1_CC_N, RTM.P30_IO6_AB_B1_CC_P, RTM.P30_IO6_CD_B1_N, RTM.P30_IO6_CD_B1_P, RTM.P30_IO6_EF_B1_N, RTM.P30_IO6_EF_B1_P, RTM.P30_IO7_AB_B1_N, RTM.P30_IO7_AB_B1_P, RTM.P30_IO7_CD_B1_N, RTM.P30_IO7_CD_B1_P, RTM.P30_IO7_EF_B1_N, RTM.P30_IO7_EF_B1_P, RTM.P30_IO8_AB_B1_N, RTM.P30_IO8_AB_B1_P, RTM.P30_IO8_CD_B1_N, RTM.P30_IO8_CD_B1_P, RTM.P30_IO8_EF_B1_N, RTM.P30_IO8_EF_B1_P, RTM.P30_IO9_AB_B2_CC_N, RTM.P30_IO9_AB_B2_CC_P, RTM.P30_IO9_CD_B2_N, RTM.P30_IO9_CD_B2_P, RTM.P30_IO9_EF_B2_N, RTM.P30_IO9_EF_B2_P, RTM.P30_IO10_AB_B2_CC_N, RTM.P30_IO10_AB_B2_CC_P, RTM.P30_IO10_CD_B2_N, RTM.P30_IO10_CD_B2_P, RTM.P30_IO10_EF_B2_N, RTM.P30_IO10_EF_B2_P, RTM.P30_OUT0_N, RTM.P30_OUT0_P, RTM.P30_OUT1_N, RTM.P30_OUT1_P, RTM.P30_OUT2_N, RTM.P30_OUT2_P, RTM.P31_IO1_AB_B2_N, RTM.P31_IO1_AB_B2_P, RTM.P31_IO1_CD_B2_N, RTM.P31_IO1_CD_B2_P, RTM.P31_IO1_EF_B2_N, RTM.P31_IO1_EF_B2_P, RTM.P31_IO2_AB_B2_N, RTM.P31_IO2_AB_B2_P, RTM.P31_IO2_CD_B2_N, RTM.P31_IO2_CD_B2_P, RTM.P31_IO2_EF_B2_N, RTM.P31_IO2_EF_B2_P, RTM.P31_IO3_AB_B2_N, RTM.P31_IO3_AB_B2_P, RTM.P31_IO4_AB_B2_N, RTM.P31_IO4_AB_B2_P, RTM.P31_IO7_AB_B3_CC_N, RTM.P31_IO7_AB_B3_CC_P, RTM.P31_IO8_AB_B3_CC_N, RTM.P31_IO8_AB_B3_CC_P
net class FMC2: FMC2_VREF_A_M2C, FMC2_VREF_B_M2C, HA2_HA00_CC_N, HA2_HA00_CC_P, HA2_HA01_CC_N, HA2_HA01_CC_P, HA2_HA02_N, HA2_HA02_P, HA2_HA03_N, HA2_HA03_P, HA2_HA04_N, HA2_HA04_P, HA2_HA05_N, HA2_HA05_P, HA2_HA06_N, HA2_HA06_P, HA2_HA07_N, HA2_HA07_P, HA2_HA08_N, HA2_HA08_P, HA2_HA09_N, HA2_HA09_P, HA2_HA10_N, HA2_HA10_P, HA2_HA11_N, HA2_HA11_P, HA2_HA12_N, HA2_HA12_P, HA2_HA13_N, HA2_HA13_P, HA2_HA14_N, HA2_HA14_P, HA2_HA15_N, HA2_HA15_P, HA2_HA16_N, HA2_HA16_P, HA2_HA17_CC_N, HA2_HA17_CC_P, HA2_HA18_N, HA2_HA18_P, HA2_HA19_N, HA2_HA19_P, HA2_HA20_N, HA2_HA20_P, HA2_HA21_N, HA2_HA21_P, HA2_HA22_N, HA2_HA22_P, HA2_HA23_N, HA2_HA23_P, LA2_LA00_CC_N, LA2_LA00_CC_P, LA2_LA01_CC_N, LA2_LA01_CC_P, LA2_LA02_N, LA2_LA02_P, LA2_LA03_N, LA2_LA03_P, LA2_LA04_N, LA2_LA04_P, LA2_LA05_N, LA2_LA05_P, LA2_LA06_N, LA2_LA06_P, LA2_LA07_N, LA2_LA07_P, LA2_LA08_N, LA2_LA08_P, LA2_LA09_N, LA2_LA09_P, LA2_LA10_N, LA2_LA10_P, LA2_LA11_N, LA2_LA11_P, LA2_LA12_N, LA2_LA12_P, LA2_LA13_N, LA2_LA13_P, LA2_LA14_N, LA2_LA14_P, LA2_LA15_N, LA2_LA15_P, LA2_LA16_N, LA2_LA16_P, LA2_LA17_CC_N, LA2_LA17_CC_P, LA2_LA18_CC_N, LA2_LA18_CC_P, LA2_LA19_N, LA2_LA19_P, LA2_LA20_N, LA2_LA20_P, LA2_LA21_N, LA2_LA21_P, LA2_LA22_N, LA2_LA22_P, LA2_LA23_N, LA2_LA23_P, LA2_LA24_N, LA2_LA24_P, LA2_LA25_N, LA2_LA25_P, LA2_LA26_N, LA2_LA26_P, LA2_LA27_N, LA2_LA27_P, LA2_LA28_N, LA2_LA28_P, LA2_LA29_N, LA2_LA29_P, LA2_LA30_N, LA2_LA30_P, LA2_LA31_N, LA2_LA31_P, LA2_LA32_N, LA2_LA32_P, LA2_LA33_N, LA2_LA33_P
net class SE60DE100: HA2_HA00_CC_N, HA2_HA00_CC_P, HA2_HA01_CC_N, HA2_HA01_CC_P, HA2_HA02_N, HA2_HA02_P, HA2_HA03_N, HA2_HA03_P, HA2_HA04_N, HA2_HA04_P, HA2_HA05_N, HA2_HA05_P, HA2_HA06_N, HA2_HA06_P, HA2_HA07_N, HA2_HA07_P, HA2_HA08_N, HA2_HA08_P, HA2_HA09_N, HA2_HA09_P, HA2_HA10_N, HA2_HA10_P, HA2_HA11_N, HA2_HA11_P, HA2_HA12_N, HA2_HA12_P, HA2_HA13_N, HA2_HA13_P, HA2_HA14_N, HA2_HA14_P, HA2_HA15_N, HA2_HA15_P, HA2_HA16_N, HA2_HA16_P, HA2_HA17_CC_N, HA2_HA17_CC_P, HA2_HA18_N, HA2_HA18_P, HA2_HA19_N, HA2_HA19_P, HA2_HA20_N, HA2_HA20_P, HA2_HA21_N, HA2_HA21_P, HA2_HA22_N, HA2_HA22_P, HA2_HA23_N, HA2_HA23_P, HB2_HB00_CC_N, HB2_HB00_CC_P, HB2_HB01_N, HB2_HB01_P, HB2_HB02_N, HB2_HB02_P, HB2_HB03_N, HB2_HB03_P, HB2_HB04_N, HB2_HB04_P, HB2_HB05_N, HB2_HB05_P, HB2_HB06_CC_N, HB2_HB06_CC_P, HB2_HB07_N, HB2_HB07_P, HB2_HB08_N, HB2_HB08_P, HB2_HB09_N, HB2_HB09_P, HB2_HB10_N, HB2_HB10_P, HB2_HB11_N, HB2_HB11_P, HB2_HB12_N, HB2_HB12_P, HB2_HB13_N, HB2_HB13_P, HB2_HB14_N, HB2_HB14_P, HB2_HB15_N, HB2_HB15_P, HB2_HB16_N, HB2_HB16_P, HB2_HB17_CC_N, HB2_HB17_CC_P, HB2_HB18_N, HB2_HB18_P, HB2_HB19_N, HB2_HB19_P, HB2_HB20_N, HB2_HB20_P, HB2_HB21_N, HB2_HB21_P, LA2_LA00_CC_N, LA2_LA00_CC_P, LA2_LA01_CC_N, LA2_LA01_CC_P, LA2_LA02_N, LA2_LA02_P, LA2_LA03_N, LA2_LA03_P, LA2_LA04_N, LA2_LA04_P, LA2_LA05_N, LA2_LA05_P, LA2_LA06_N, LA2_LA06_P, LA2_LA07_N, LA2_LA07_P, LA2_LA08_N, LA2_LA08_P, LA2_LA09_N, LA2_LA09_P, LA2_LA10_N, LA2_LA10_P, LA2_LA11_N, LA2_LA11_P, LA2_LA12_N, LA2_LA12_P, LA2_LA13_N, LA2_LA13_P, LA2_LA14_N, LA2_LA14_P, LA2_LA15_N, LA2_LA15_P, LA2_LA16_N, LA2_LA16_P, LA2_LA17_CC_N, LA2_LA17_CC_P, LA2_LA18_CC_N, LA2_LA18_CC_P, LA2_LA19_N, LA2_LA19_P, LA2_LA20_N, LA2_LA20_P, LA2_LA21_N, LA2_LA21_P, LA2_LA22_N, LA2_LA22_P, LA2_LA23_N, LA2_LA23_P, LA2_LA24_N, LA2_LA24_P, LA2_LA25_N, LA2_LA25_P, LA2_LA26_N, LA2_LA26_P, LA2_LA27_N, LA2_LA27_P, LA2_LA28_N, LA2_LA28_P, LA2_LA29_N, LA2_LA29_P, LA2_LA30_N, LA2_LA30_P, LA2_LA31_N, LA2_LA31_P, LA2_LA32_N, LA2_LA32_P, LA2_LA33_N, LA2_LA33_P
net class DE_SIG: HA2_HA00_CC_N, HA2_HA00_CC_P, HA2_HA01_CC_N, HA2_HA01_CC_P, HA2_HA02_N, HA2_HA02_P, HA2_HA03_N, HA2_HA03_P, HA2_HA04_N, HA2_HA04_P, HA2_HA05_N, HA2_HA05_P, HA2_HA06_N, HA2_HA06_P, HA2_HA07_N, HA2_HA07_P, HA2_HA08_N, HA2_HA08_P, HA2_HA09_N, HA2_HA09_P, HA2_HA10_N, HA2_HA10_P, HA2_HA11_N, HA2_HA11_P, HA2_HA12_N, HA2_HA12_P, HA2_HA13_N, HA2_HA13_P, HA2_HA14_N, HA2_HA14_P, HA2_HA15_N, HA2_HA15_P, HA2_HA16_N, HA2_HA16_P, HA2_HA17_CC_N, HA2_HA17_CC_P, HA2_HA18_N, HA2_HA18_P, HA2_HA19_N, HA2_HA19_P, HA2_HA20_N, HA2_HA20_P, HA2_HA21_N, HA2_HA21_P, HA2_HA22_N, HA2_HA22_P, HA2_HA23_N, HA2_HA23_P, HB2_HB00_CC_N, HB2_HB00_CC_P, HB2_HB01_N, HB2_HB01_P, HB2_HB02_N, HB2_HB02_P, HB2_HB03_N, HB2_HB03_P, HB2_HB04_N, HB2_HB04_P, HB2_HB05_N, HB2_HB05_P, HB2_HB06_CC_N, HB2_HB06_CC_P, HB2_HB07_N, HB2_HB07_P, HB2_HB08_N, HB2_HB08_P, HB2_HB09_N, HB2_HB09_P, HB2_HB10_N, HB2_HB10_P, HB2_HB11_N, HB2_HB11_P, HB2_HB12_N, HB2_HB12_P, HB2_HB13_N, HB2_HB13_P, HB2_HB14_N, HB2_HB14_P, HB2_HB15_N, HB2_HB15_P, HB2_HB16_N, HB2_HB16_P, HB2_HB17_CC_N, HB2_HB17_CC_P, HB2_HB18_N, HB2_HB18_P, HB2_HB19_N, HB2_HB19_P, HB2_HB20_N, HB2_HB20_P, HB2_HB21_N, HB2_HB21_P, LA2_LA00_CC_N, LA2_LA00_CC_P, LA2_LA01_CC_N, LA2_LA01_CC_P, LA2_LA02_N, LA2_LA02_P, LA2_LA03_N, LA2_LA03_P, LA2_LA04_N, LA2_LA04_P, LA2_LA05_N, LA2_LA05_P, LA2_LA06_N, LA2_LA06_P, LA2_LA07_N, LA2_LA07_P, LA2_LA08_N, LA2_LA08_P, LA2_LA09_N, LA2_LA09_P, LA2_LA10_N, LA2_LA10_P, LA2_LA11_N, LA2_LA11_P, LA2_LA12_N, LA2_LA12_P, LA2_LA13_N, LA2_LA13_P, LA2_LA14_N, LA2_LA14_P, LA2_LA15_N, LA2_LA15_P, LA2_LA16_N, LA2_LA16_P, LA2_LA17_CC_N, LA2_LA17_CC_P, LA2_LA18_CC_N, LA2_LA18_CC_P, LA2_LA19_N, LA2_LA19_P, LA2_LA20_N, LA2_LA20_P, LA2_LA21_N, LA2_LA21_P, LA2_LA22_N, LA2_LA22_P, LA2_LA23_N, LA2_LA23_P, LA2_LA24_N, LA2_LA24_P, LA2_LA25_N, LA2_LA25_P, LA2_LA26_N, LA2_LA26_P, LA2_LA27_N, LA2_LA27_P, LA2_LA28_N, LA2_LA28_P, LA2_LA29_N, LA2_LA29_P, LA2_LA30_N, LA2_LA30_P, LA2_LA31_N, LA2_LA31_P, LA2_LA32_N, LA2_LA32_P, LA2_LA33_N, LA2_LA33_P
net class FMC2_HA: HA2_HA00_CC_N, HA2_HA00_CC_P, HA2_HA01_CC_N, HA2_HA01_CC_P, HA2_HA02_N, HA2_HA02_P, HA2_HA03_N, HA2_HA03_P, HA2_HA04_N, HA2_HA04_P, HA2_HA05_N, HA2_HA05_P, HA2_HA06_N, HA2_HA06_P, HA2_HA07_N, HA2_HA07_P, HA2_HA08_N, HA2_HA08_P, HA2_HA09_N, HA2_HA09_P, HA2_HA10_N, HA2_HA10_P, HA2_HA11_N, HA2_HA11_P, HA2_HA12_N, HA2_HA12_P, HA2_HA13_N, HA2_HA13_P, HA2_HA14_N, HA2_HA14_P, HA2_HA15_N, HA2_HA15_P, HA2_HA16_N, HA2_HA16_P, HA2_HA17_CC_N, HA2_HA17_CC_P, HA2_HA18_N, HA2_HA18_P, HA2_HA19_N, HA2_HA19_P, HA2_HA20_N, HA2_HA20_P, HA2_HA21_N, HA2_HA21_P, HA2_HA22_N, HA2_HA22_P, HA2_HA23_N, HA2_HA23_P
net class POWER: FMC2_VREF_A_M2C, FMC2_VREF_B_M2C
net class FMC2_REST: FMC2_VREF_A_M2C, FMC2_VREF_B_M2C
net class FMC2_HB: HB2_HB00_CC_N, HB2_HB00_CC_P, HB2_HB01_N, HB2_HB01_P, HB2_HB02_N, HB2_HB02_P, HB2_HB03_N, HB2_HB03_P, HB2_HB04_N, HB2_HB04_P, HB2_HB05_N, HB2_HB05_P, HB2_HB06_CC_N, HB2_HB06_CC_P, HB2_HB07_N, HB2_HB07_P, HB2_HB08_N, HB2_HB08_P, HB2_HB09_N, HB2_HB09_P, HB2_HB10_N, HB2_HB10_P, HB2_HB11_N, HB2_HB11_P, HB2_HB12_N, HB2_HB12_P, HB2_HB13_N, HB2_HB13_P, HB2_HB14_N, HB2_HB14_P, HB2_HB15_N, HB2_HB15_P, HB2_HB16_N, HB2_HB16_P, HB2_HB17_CC_N, HB2_HB17_CC_P, HB2_HB18_N, HB2_HB18_P, HB2_HB19_N, HB2_HB19_P, HB2_HB20_N, HB2_HB20_P, HB2_HB21_N, HB2_HB21_P
net class FMC2_LA: LA2_LA00_CC_N, LA2_LA00_CC_P, LA2_LA01_CC_N, LA2_LA01_CC_P, LA2_LA02_N, LA2_LA02_P, LA2_LA03_N, LA2_LA03_P, LA2_LA04_N, LA2_LA04_P, LA2_LA05_N, LA2_LA05_P, LA2_LA06_N, LA2_LA06_P, LA2_LA07_N, LA2_LA07_P, LA2_LA08_N, LA2_LA08_P, LA2_LA09_N, LA2_LA09_P, LA2_LA10_N, LA2_LA10_P, LA2_LA11_N, LA2_LA11_P, LA2_LA12_N, LA2_LA12_P, LA2_LA13_N, LA2_LA13_P, LA2_LA14_N, LA2_LA14_P, LA2_LA15_N, LA2_LA15_P, LA2_LA16_N, LA2_LA16_P, LA2_LA17_CC_N, LA2_LA17_CC_P, LA2_LA18_CC_N, LA2_LA18_CC_P, LA2_LA19_N, LA2_LA19_P, LA2_LA20_N, LA2_LA20_P, LA2_LA21_N, LA2_LA21_P, LA2_LA22_N, LA2_LA22_P, LA2_LA23_N, LA2_LA23_P, LA2_LA24_N, LA2_LA24_P, LA2_LA25_N, LA2_LA25_P, LA2_LA26_N, LA2_LA26_P, LA2_LA27_N, LA2_LA27_P, LA2_LA28_N, LA2_LA28_P, LA2_LA29_N, LA2_LA29_P, LA2_LA30_N, LA2_LA30_P, LA2_LA31_N, LA2_LA31_P, LA2_LA32_N, LA2_LA32_P, LA2_LA33_N, LA2_LA33_P
net class BANK_12: HA00_CC_N, HA00_CC_P, HA01_CC_N, HA01_CC_P, HA02_N, HA02_P, HA03_N, HA03_P, HA04_N, HA04_P, HA05_N, HA05_P, HA06_N, HA06_P, HA07_N, HA07_P, HA08_N, HA08_P, HA09_N, HA09_P, HA10_N, HA10_P, HA11_N, HA11_P, HA12_N, HA12_P, HA13_N, HA13_P, HA14_N, HA14_P, HA15_N, HA15_P, HA16_N, HA16_P, HA17_CC_N, HA17_CC_P, HA18_N, HA18_P, HA19_N, HA19_P, HA20_N, HA20_P, HA21_N, HA21_P, HA22_N, HA22_P, HA23_N, HA23_P, VADJ2_PLL_DAC1_SCLK, VADJ2_PLL_DAC2_SCLK
net class BANK_13: FMC2_PRSNT_M2C, FMC2_VREF_A_M2C, FPGA_RESET_Dn, LA2_LA00_CC_N, LA2_LA00_CC_P, LA2_LA01_CC_N, LA2_LA01_CC_P, LA2_LA02_N, LA2_LA02_P, LA2_LA03_N, LA2_LA03_P, LA2_LA04_N, LA2_LA04_P, LA2_LA05_N, LA2_LA05_P, LA2_LA06_N, LA2_LA06_P, LA2_LA07_N, LA2_LA07_P, LA2_LA08_N, LA2_LA08_P, LA2_LA09_N, LA2_LA09_P, LA2_LA10_N, LA2_LA10_P, LA2_LA11_N, LA2_LA11_P, LA2_LA12_N, LA2_LA12_P, LA2_LA13_N, LA2_LA13_P, LA2_LA14_N, LA2_LA14_P, LA2_LA15_N, LA2_LA15_P, LA2_LA16_N, LA2_LA16_P, VADJ2_PLL_DAC1_DIN, VADJ2_PLL_DAC2_DIN, VADJ2_SI57X_OE
net class BANK_14: FLASH_D2, FLASH_D3, FLASH_FCS_~{B}, FLASH_Q/D1, FLASH_SI/D0, FMC2_VREF_A_M2C, LA2_LA17_CC_N, LA2_LA17_CC_P, LA2_LA18_CC_N, LA2_LA18_CC_P, LA2_LA19_N, LA2_LA19_P, LA2_LA20_N, LA2_LA20_P, LA2_LA21_N, LA2_LA21_P, LA2_LA22_N, LA2_LA22_P, LA2_LA23_N, LA2_LA23_P, LA2_LA24_N, LA2_LA24_P, LA2_LA25_N, LA2_LA25_P, LA2_LA26_N, LA2_LA26_P, LA2_LA27_N, LA2_LA27_P, LA2_LA28_N, LA2_LA28_P, LA2_LA29_N, LA2_LA29_P, LA2_LA30_N, LA2_LA30_P, LA2_LA31_N, LA2_LA31_P, LA2_LA32_N, LA2_LA32_P, LA2_LA33_N, LA2_LA33_P, PUDC, VADJ2_SI57X_PRI_SCL, VADJ2_SI57X_PRI_SDA
net class BANK_15: FMC2_VREF_B_M2C, HB00_CC_N, HB00_CC_P, HB01_N, HB01_P, HB02_N, HB02_P, HB03_N, HB03_P, HB04_N, HB04_P, HB05_N, HB05_P, HB06_CC_N, HB06_CC_P, HB07_N, HB07_P, HB08_N, HB08_P, HB09_N, HB09_P, HB10_N, HB10_P, HB11_N, HB11_P, HB12_N, HB12_P, HB13_N, HB13_P, HB14_N, HB14_P, HB15_N, HB15_P, HB16_N, HB16_P, HB17_CC_N, HB17_CC_P, HB18_N, HB18_P, HB19_N, HB19_P, HB20_N, HB20_P, HB21_N, HB21_P, VADJ2_SI57X_PRI_TUNE/SYNC, VADJ2_SI57X_SEC_TUNE/SYNC
net class FMC2_HA_CC: HA2_HA00_CC_N, HA2_HA00_CC_P, HA2_HA01_CC_N, HA2_HA01_CC_P, HA2_HA16_P, HA2_HA17_CC_N, HA2_HA17_CC_P
net class FMC2_HB_CC: HB2_HB00_CC_N, HB2_HB00_CC_P, HB2_HB06_CC_N, HB2_HB06_CC_P, HB2_HB16_P, HB2_HB17_CC_N, HB2_HB17_CC_P
net class FMC2_LA_CC: LA2_LA00_CC_N, LA2_LA00_CC_P, LA2_LA01_CC_N, LA2_LA01_CC_P, LA2_LA17_CC_N, LA2_LA17_CC_P, LA2_LA18_CC_N, LA2_LA18_CC_P

## Notes on the sheet
- Project/Equipment
- Document
- Designer
- Drawn by
- Check.by
- Last Mod.
- Copyright CNPEM 2013, WUT ISE 2020
  This documentation describes Open Hardware and is licensed under CERN OHL v.1.1. You may redistribute and modify this documentaction under the terms of the CERN OHL v1.1.
  (http://ohwr.org/CERNOHL). This documentation is dristributed WITHOUT ANY EXPRESS OR IMPLIED WARRANTY, INCLUDING OF MERCHANTABLITY, SATISFACTORY QUALITY AND FITNESS FOR A PARTICULAR PURPOSE. Please see the CERN OHL v.1.1 for applicable conditions
- Contact:
- File
- Print Date
- Sheet
- Size
- A2
- of
- Rev
- (in symbol R0201_100R_1%_0.05W_200PPM) 1%
- (in symbol R0402_10K_1%_0.0625W_100PPM) 1%
- (in symbol R0402_240R_1%_0.0625W_100PPM) 1%
- (in symbol XC7A200T-3FFG1156C, part A) BANK 12
- (in symbol XC7A200T-3FFG1156C, part B) BANK 13
- (in symbol XC7A200T-3FFG1156C, part C) BANK 14
- (in symbol XC7A200T-3FFG1156C, part D) BANK 15

## Library data of the parts
C124 C125 C129 C131 C132 C392 = CC0201_100NF_6.3V_10%_X5R: Non-polarised capacitor; Part Description: SMD Multilayer Chip Ceramic Capacitor; Manufacturer: GENERIC; Manufacturer1 Part Number: 02016D104KAT2A; Voltage: 6.3V; TC: X5R; Tolerance: ±10%; Table: Capacitors SMD; Part Number: CC0201_100NF_6.3V_10%_X5R; Component Kind: Standard; Component Type: Standard; Pin Count: 2; Value: 100nF; Status: Not Recommended; Manufacturer Part Number: CC0201_100NF_6.3V_10%_X5R; Case: 0201; Mounted: Yes; Socket: No; SMD: Yes; Manufacturer1 Example: AVX; Manufacturer1 ComponentHeight: 0.33mm; HelpURL: \\cern.ch\dfs\Applications\Altium\Datasheets\CC0201_X5R_AVX.pdf; Author: CERN DEM JLC; CreateDate: 2007-12-03; LatestRevisionDate: 2007-12-03
C416 C459 C468 = CC0201_100NF_6.3V_10%_X5R: Non-polarised capacitor; Manufacturer: GENERIC; Part Description: SMD Multilayer Chip Ceramic Capacitor; Manufacturer1 Part Number: 02016D104KAT2A; Tolerance: ±10%; Voltage: 6.3V; TC: X5R; Manufacturer Part Number: CC0201_100NF_6.3V_10%_X5R; Part Number: CC0201_100NF_6.3V_10%_X5R; Value: 100nF; Component Kind: Standard; Component Type: Standard; Pin Count: 2; Status: Not Recommended; Case: 0201; Mounted: Yes; Socket: No; SMD: Yes; Sense: No; Manufacturer1 Example: AVX; Manufacturer1 ComponentHeight: 0.33mm; HelpURL: \\cern.ch\dfs\Applications\Altium\Datasheets\CC0201_X5R_AVX.pdf; Author: CERN DEM JLC; CreateDate: 03.12.2007; LatestRevisionDate: 03.12.2007
D3 = BAT165: Schottky Diode; Part Description: Medium Power AF Schottky Diode; Manufacturer: INFINEON; Voltage: 40V; Power: 750mA; PressFit: No; Bonding: No; Part Number: BAT165; Component Kind: Standard; Component Type: Standard; Device: BAT165; PackageDescription: Small Outline Diode (SOD-323), 1.70mm W X 1.25mm L X 1.10mm H body,  IPC Medium Density; Manufacturer Part Number: BAT165; Pin Count: 2; Case: SOD323; Mounted: Yes; Socket: No; SMD: Yes; Sense: No; ComponentHeight: 1.1mm; HelpURL: \\cern.ch\dfs\Applications\Altium\Datasheets\BAT165.pdf; Author: CERN DEM JLC; CreateDate: 12.11.2014; LatestRevisionDate: 12.11.2014
D30 = BAT165: Schottky Diode; Manufacturer: INFINEON; Part Description: Medium Power AF Schottky Diode; Voltage: 40V; Power: 750mA; PressFit: No; Bonding: No; Manufacturer Part Number: BAT165; PackageDescription: Small Outline Diode (SOD-323), 1.70mm W X 1.25mm L X 1.10mm H body,  IPC Medium Density; Part Number: BAT165; Component Kind: Standard; Component Type: Standard; Device: BAT165; Pin Count: 2; Case: SOD323; Mounted: Yes; Socket: No; SMD: Yes; Sense: No; ComponentHeight: 1.1mm; HelpURL: \\cern.ch\dfs\Applications\Altium\Datasheets\BAT165.pdf; Author: CERN DEM JLC; CreateDate: 12.11.2014; LatestRevisionDate: 12.11.2014
IC2 = XC7A200T-3FFG1156C: Artix-6 FPGA, 16 GTPs, 600 User I/Os, 1156-Pin BGA, Speed Grade 2, Commercial Grade, Pb-Free; Part Description: Artix-7 FPGA, 16 GTPs, 600 User I/Os, 1156-Pin BGA, Speed Grade 2, Commercial Grade, Pb-Free; Manufacturer: XILINX; Table: Logic; Part Number: XC7A200T-3FFG1156C; Component Kind: Standard; Component Type: Standard; Device: XC7A200T-3FFG1156C; PackageDescription: BGA, 1.00mm Pitch, Square; 1156 Pin, 34 Columns X 34 Rows, 35.00mm X 35.00mm X 3.350mm H; Manufacturer Part Number: XC7A200T-3FFG1156C; Pin Count: 1156; Case: BGA1156; Mounted: Yes; Socket: No; SMD: Yes; ComponentHeight: 3.35mm; HelpURL: \\cern.ch\dfs\Applications\Altium\Datasheets\XC7A350T-2FFG1156C.pdf; ComponentLink1URL: \\cern.ch\dfs\Applications\Altium\Datasheets\XC7A350T-2FFG1156C.pdf; ComponentLink1Description: Package/Pinout; Author: CERN DEM JLC; CreateDate: 2012-09-19; LatestRevisionDate: 2012-09-19
R51 R215 R216 R243 R245 R249-R252 R358-R360 R362-R364 R366 R368 R370 R372 R374-R376 R378 R385 R386 R390 R438 R442 R445 R448 R450 R475 R476 R478-R480 R482-R484 R486 R488 R490 R492 R494 R496 R498 R500 R502 R504 R506 R508 R510 R512 R514 R516 R518 R520 R522 R524-R549 = R0201_0R_JUMPER: Resistor; Part Description: 1A (0.05R Max DC Resistance) Zero Ohm Jumper; Manufacturer: GENERIC; Manufacturer1 Part Number: CRCW02010000Z0ED; PressFit: No; Part Number: R0201_0R_JUMPER; Component Kind: Standard; Component Type: Standard; Pin Count: 2; Value: 0; Status: Not Recommended; Manufacturer Part Number: R0201_0R_JUMPER; Case: 0201; Mounted: Yes; Sense: No; Socket: No; SMD: Yes; Manufacturer1 Example: VISHAY; Manufacturer1 ComponentHeight: 0.27mm; HelpURL: \\cern.ch\dfs\Applications\Altium\Datasheets\R0201_VISHAY_CRCW e3.pdf; Author: CERN DEM JLC; CreateDate: 19.11.2014; LatestRevisionDate: 08.01.2015
R123 R148 = R0402_240R_1%_0.0625W_100PPM: Resistor - 1%; Manufacturer: GENERIC; Part Description: General Purpose Thick Film Chip Resistor; Manufacturer1 Part Number: 232270672401L; TC: ±100ppm/°C; PressFit: No; Manufacturer Part Number: R0402_240R_1%_0.0625W_100PPM; Part Number: R0402_240R_1%_0.0625W_100PPM; Tolerance: ±1%; Value: 240; Component Kind: Standard; Component Type: Standard; Pin Count: 2; Status: Not Recommended; Power: 0.0625W; Case: 0402; Mounted: Yes; Sense: No; Socket: No; SMD: Yes; Manufacturer1 Example: YAGEO PHYCOMP; Manufacturer1 ComponentHeight: 0.4mm; HelpURL: \\cern.ch\dfs\Applications\Altium\Datasheets\R0402_Phycomp_RC0402.pdf; Author: CERN DEM JLC; CreateDate: 03.12.2007; LatestRevisionDate: 17.10.2012
R149 R300 R306 R319 = R0402_10K_1%_0.0625W_100PPM: Resistor - 1%; Manufacturer: GENERIC; Part Description: General Purpose Thick Film Chip Resistor; Manufacturer1 Part Number: 232270671003L; TC: ±100ppm/°C; PressFit: No; Manufacturer Part Number: R0402_10K_1%_0.0625W_100PPM; Part Number: R0402_10K_1%_0.0625W_100PPM; Tolerance: ±1%; Value: 10k; Component Kind: Standard; Component Type: Standard; Pin Count: 2; Status: Not Recommended; Power: 0.0625W; Case: 0402; Mounted: Yes; Sense: No; Socket: No; SMD: Yes; Manufacturer1 Example: YAGEO PHYCOMP; Manufacturer1 ComponentHeight: 0.4mm; HelpURL: \\cern.ch\dfs\Applications\Altium\Datasheets\R0402_Phycomp_RC0402.pdf; Author: CERN DEM JLC; CreateDate: 03.12.2007; LatestRevisionDate: 17.10.2012
R150 R318 = R0201_100R_1%_0.05W_200PPM: Resistor - 1%; Manufacturer: GENERIC; Part Description: Thick Film Chip Resistor; Manufacturer1 Part Number: CRCW0201100RFNED; Power: 0.05W; TC: ±200ppm/°C; PressFit: No; Manufacturer Part Number: R0201_100R_1%_0.05W_200PPM; Part Number: R0201_100R_1%_0.05W_200PPM; Tolerance: ±1%; Value: 100; Component Kind: Standard; Component Type: Standard; Pin Count: 2; Status: Not Recommended; Case: 0201; Mounted: Yes; Sense: No; Socket: No; SMD: Yes; Manufacturer1 Example: VISHAY; Manufacturer1 ComponentHeight: 0.27mm; HelpURL: \\cern.ch\dfs\Applications\Altium\Datasheets\R0201_VISHAY_CRCW0201 e3.pdf; Author: CERN DEM JLC; CreateDate: 13.11.2014; LatestRevisionDate: 13.11.2014
R180 R270 R323 = R0402_10K_1%_0.0625W_100PPM: Resistor - 1%; Part Description: General Purpose Thick Film Chip Resistor; Manufacturer: GENERIC; Manufacturer1 Part Number: 232270671003L; TC: ±100ppm/°C; Table: Resistors SMD; Part Number: R0402_10K_1%_0.0625W_100PPM; Component Kind: Standard; Component Type: Standard; Pin Count: 2; Value: 10k; Status: Not recommended; Power: 0.0625W; Tolerance: ±1%; Manufacturer Part Number: R0402_10K_1%_0.0625W_100PPM; Case: 0402; Mounted: Yes; Socket: No; SMD: Yes; Manufacturer1 Example: YAGEO PHYCOMP; Manufacturer1 ComponentHeight: 0.4mm; HelpURL: \\cern.ch\dfs\Applications\Altium\Datasheets\R0402_Phycomp_RC0402.pdf; Author: CERN DEM JLC; CreateDate: 2007-12-03; LatestRevisionDate: 2012-10-17
TP4 TP13-TP15 = TP: Testpoint